# Altium schematic sheet ControlBoardConnector.SchDoc
size A4; DocumentNumber: 10; SheetNumber: 13; SheetTotal: 15
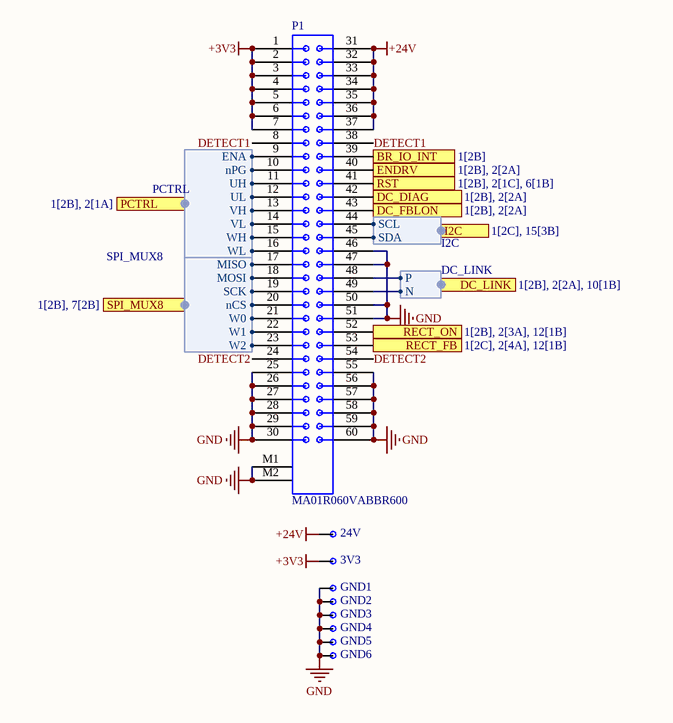
[diagram p0: ControlBoardConnector.SchDoc]

## Parts
3V3  Testpoint  [Testpoint-Footprint-1]  (value not drawn)  (no BOM)
24V  Testpoint  [Testpoint-Footprint-1]  (value not drawn)  (no BOM)
GND1  Testpoint  [Testpoint-Footprint-1]  (value not drawn)  (no BOM)
GND2  Testpoint  [Testpoint-Footprint-1]  (value not drawn)  (no BOM)
GND3  Testpoint  [Testpoint-Footprint-1]  (value not drawn)  (no BOM)
GND4  Testpoint  [Testpoint-Footprint-1]  (value not drawn)  (no BOM)
GND5  Testpoint  [Testpoint-Footprint-1]  (value not drawn)  (no BOM)
GND6  Testpoint  [Testpoint-Footprint-1]  (value not drawn)  (no BOM)
P1  MA01R060VABBR600  [MA01F060VABBR300-Footprint-1]

## Ports
BR_IO_INT (in, see 1[2B]), DC_DIAG (in, see 1[2B], 2[2A]), DC_FBLON (out, see 1[2B], 2[2A]), DC_LINK (out, harness DC_LINK, see 1[2B], 2[2A], 10[1B]), ENDRV (out, see 1[2B], 2[2A]), I2C (harness I2C, see 1[2C], 15[3B]), PCTRL (harness PCTRL, see 1[2B], 2[1A]), RECT_FB (in, see 1[2C], 2[4A], 12[1B]), RECT_ON (out, see 1[2B], 2[3A], 12[1B]), RST (out, see 1[2B], 2[1C], 6[1B]), SPI_MUX8 (harness SPI_MUX8, see 1[2B], 7[2B])

## Harnesses
SPI_MUX8: nCS, SCK, MISO, MOSI, W0, W1, W2
PCTRL: UH, UL, VH, VL, WH, WL, ENA, nPG
DC_LINK: P, N
I2C: SDA, SCL

## Nets
+3V3: 3V3.1 P1.1 P1.2 P1.3 P1.4 P1.5 P1.6 P1.7
+24V: 24V.1 P1.31 P1.32 P1.33 P1.34 P1.35 P1.36 P1.37
GND: GND1.1 GND2.1 GND3.1 GND4.1 GND5.1 GND6.1 P1.25 P1.26 P1.27 P1.28 P1.29 P1.30 P1.46 P1.47 P1.50 P1.51 P1.55 P1.56 P1.57 P1.58 P1.59 P1.60 P1.M1 P1.M2
BR_IO_INT: P1.39 ; port BR_IO_INT
DC_DIAG: P1.42 ; port DC_DIAG
DC_FBLON: P1.43 ; port DC_FBLON
DETECT1: P1.8 P1.38
DETECT2: P1.24 P1.54
ENDRV: P1.40 ; port ENDRV
RECT_FB: P1.53 ; port RECT_FB
RECT_ON: P1.52 ; port RECT_ON
RST: P1.41 ; port RST
NetP1_9: P1.9 ; port PCTRL.ENA
NetP1_10: P1.10 ; port PCTRL.nPG
NetP1_11: P1.11 ; port PCTRL.UH
NetP1_12: P1.12 ; port PCTRL.UL
NetP1_13: P1.13 ; port PCTRL.VH
NetP1_14: P1.14 ; port PCTRL.VL
NetP1_15: P1.15 ; port PCTRL.WH
NetP1_16: P1.16 ; port PCTRL.WL
NetP1_17: P1.17 ; port SPI_MUX8.MISO
NetP1_18: P1.18 ; port SPI_MUX8.MOSI
NetP1_19: P1.19 ; port SPI_MUX8.SCK
NetP1_20: P1.20 ; port SPI_MUX8.nCS
NetP1_21: P1.21 ; port SPI_MUX8.W0
NetP1_22: P1.22 ; port SPI_MUX8.W1
NetP1_23: P1.23 ; port SPI_MUX8.W2
NetP1_44: P1.44 ; port I2C.SCL
NetP1_45: P1.45 ; port I2C.SDA
NetP1_48: P1.48 ; port DC_LINK.P
NetP1_49: P1.49 ; port DC_LINK.N

## Library data of the parts
3V3 24V GND1-GND6 = CMP-003-000002-1
P1 = CMP-002-00095-1: Right-angle Dual Port D-Sub Connector